# EAGLE schematic OpticalBoardRev1 (EAGLE 8.2.1)
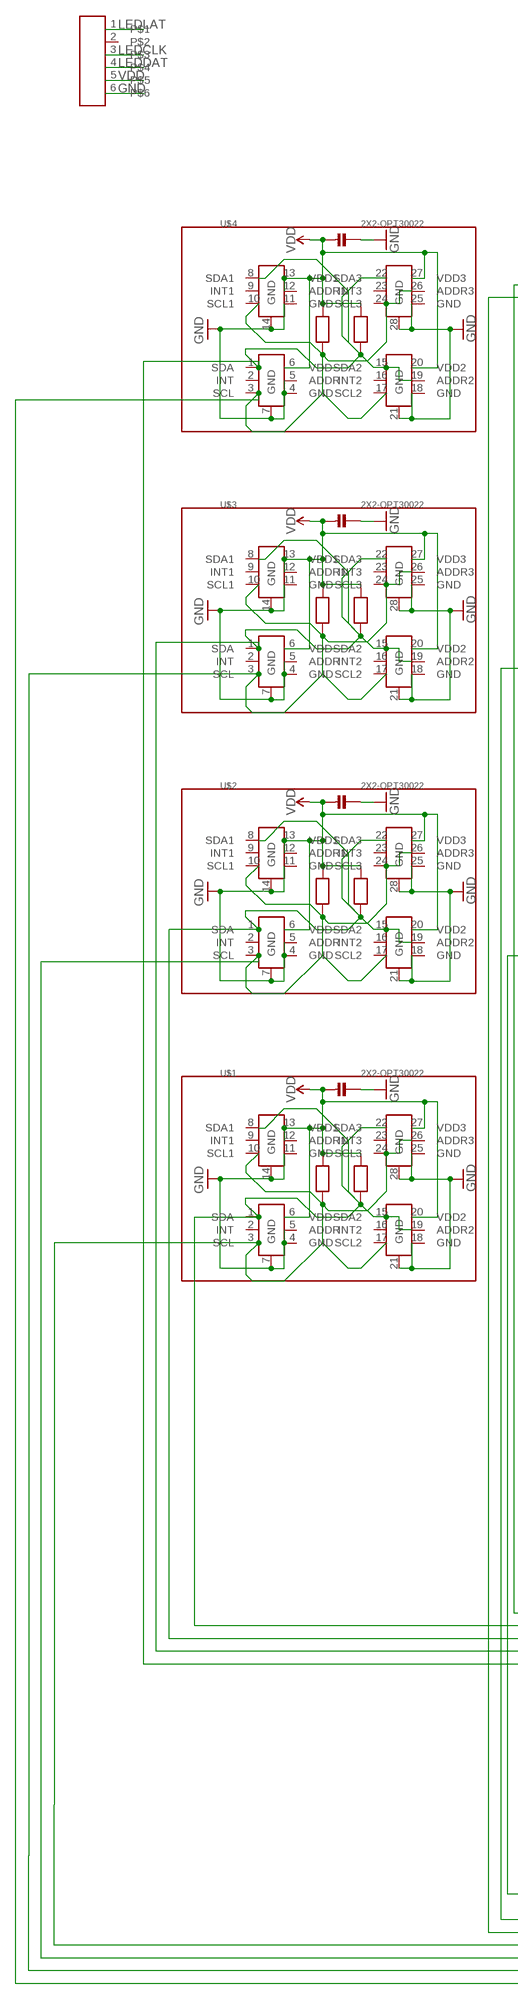
[diagram p0: schematic, sheet 1, part 1 of 2]
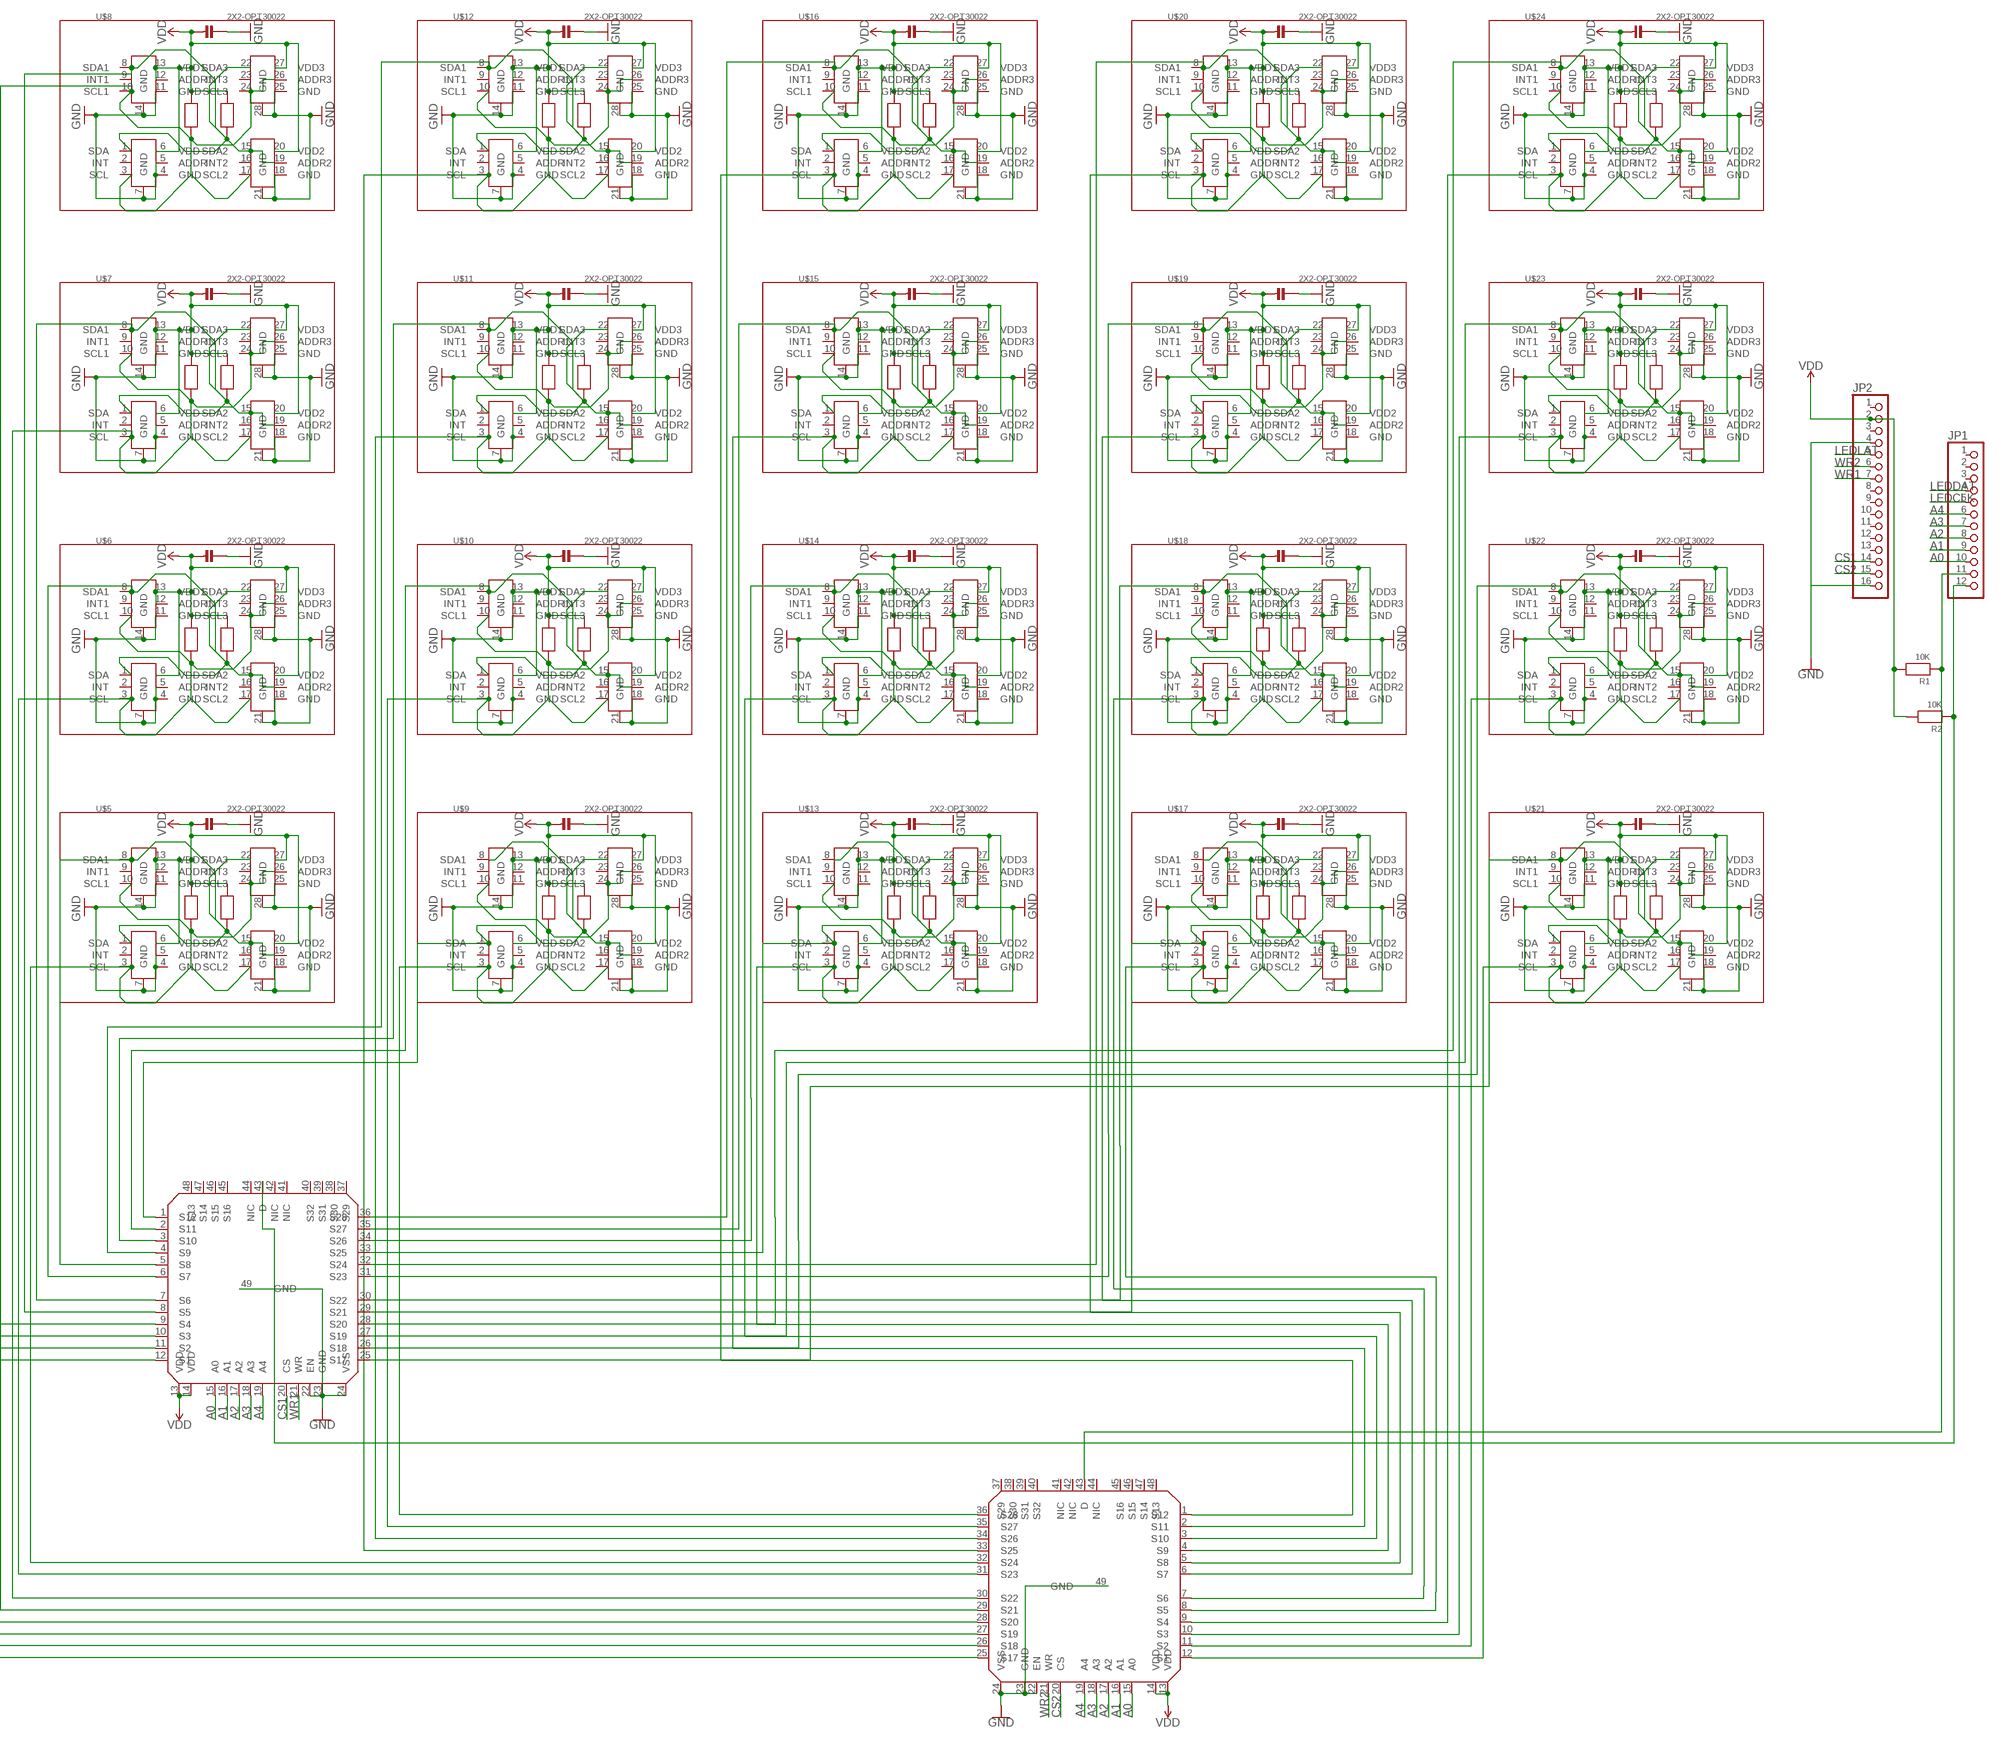
[diagram p1: schematic, sheet 1, part 2 of 2]

## Parts
JP1  HEADER-1X12  [1X12_ROUND]
JP2  HEADER-1X16ROUND  [1X16_ROUND]
R1  10K  RESISTOR_0805  [_0805]
R2  10K  RESISTOR_0805  [_0805]
U$1  2X2-OPT30022  [2X2-OPT3002-2]
U$2  2X2-OPT30022  [2X2-OPT3002-2]
U$3  2X2-OPT30022  [2X2-OPT3002-2]
U$4  2X2-OPT30022  [2X2-OPT3002-2]
U$5  2X2-OPT30022  [2X2-OPT3002-2]
U$6  2X2-OPT30022  [2X2-OPT3002-2]
U$7  2X2-OPT30022  [2X2-OPT3002-2]
U$8  2X2-OPT30022  [2X2-OPT3002-2]
U$9  2X2-OPT30022  [2X2-OPT3002-2]
U$10  2X2-OPT30022  [2X2-OPT3002-2]
U$11  2X2-OPT30022  [2X2-OPT3002-2]
U$12  2X2-OPT30022  [2X2-OPT3002-2]
U$13  2X2-OPT30022  [2X2-OPT3002-2]
U$14  2X2-OPT30022  [2X2-OPT3002-2]
U$15  2X2-OPT30022  [2X2-OPT3002-2]
U$16  2X2-OPT30022  [2X2-OPT3002-2]
U$17  2X2-OPT30022  [2X2-OPT3002-2]
U$18  2X2-OPT30022  [2X2-OPT3002-2]
U$19  2X2-OPT30022  [2X2-OPT3002-2]
U$20  2X2-OPT30022  [2X2-OPT3002-2]
U$21  2X2-OPT30022  [2X2-OPT3002-2]
U$22  2X2-OPT30022  [2X2-OPT3002-2]
U$23  2X2-OPT30022  [2X2-OPT3002-2]
U$24  2X2-OPT30022  [2X2-OPT3002-2]
U$25  CONNECTOR_6PIN  [CONNECTOR_6PIN]
U$26  32MUXTOP  [32MUX]
U$27  32MUXBOT  [32MUX_BOT]

## Nets
A0: JP1.10 U$26.15(A0) U$27.15(A0)
A1: JP1.9 U$26.16(A1) U$27.16(A1)
A2: JP1.8 U$26.17(A2) U$27.17(A2)
A3: JP1.7 U$26.18(A3) U$27.18(A3)
A4: JP1.6 U$26.19(A4) U$27.19(A4)
CS1: JP2.14 U$26.20(CS)
CS2: JP2.15 U$27.20(CS)
GND: JP2.4 JP2.16 U$1.4(GND) U$1.5(ADDR) U$1.7(GND) U$1.11(GND) U$1.14(GND) U$1.18(GND) U$1.21(GND) U$1.25(GND) U$1.28(GND) U$1.30(GND) U$2.4(GND) U$2.5(ADDR) U$2.7(GND) U$2.11(GND) U$2.14(GND) U$2.18(GND) U$2.21(GND) U$2.25(GND) U$2.28(GND) U$2.30(GND) U$3.4(GND) U$3.5(ADDR) U$3.7(GND) U$3.11(GND) U$3.14(GND) U$3.18(GND) U$3.21(GND) U$3.25(GND) U$3.28(GND) U$3.30(GND) U$4.4(GND) U$4.5(ADDR) U$4.7(GND) U$4.11(GND) U$4.14(GND) U$4.18(GND) U$4.21(GND) U$4.25(GND) U$4.28(GND) U$4.30(GND) U$5.4(GND) U$5.5(ADDR) U$5.7(GND) U$5.11(GND) U$5.14(GND) U$5.18(GND) U$5.21(GND) U$5.25(GND) U$5.28(GND) U$5.30(GND) U$6.4(GND) U$6.5(ADDR) U$6.7(GND) U$6.11(GND) U$6.14(GND) U$6.18(GND) U$6.21(GND) U$6.25(GND) U$6.28(GND) U$6.30(GND) U$7.4(GND) U$7.5(ADDR) U$7.7(GND) U$7.11(GND) U$7.14(GND) U$7.18(GND) U$7.21(GND) U$7.25(GND) U$7.28(GND) U$7.30(GND) U$8.4(GND) U$8.5(ADDR) U$8.7(GND) U$8.11(GND) U$8.14(GND) U$8.18(GND) U$8.21(GND) U$8.25(GND) U$8.28(GND) U$8.30(GND) U$9.4(GND) U$9.5(ADDR) U$9.7(GND) U$9.11(GND) U$9.14(GND) U$9.18(GND) U$9.21(GND) U$9.25(GND) U$9.28(GND) U$9.30(GND) U$10.4(GND) U$10.5(ADDR) U$10.7(GND) U$10.11(GND) U$10.14(GND) U$10.18(GND) U$10.21(GND) U$10.25(GND) U$10.28(GND) U$10.30(GND) U$11.4(GND) U$11.5(ADDR) U$11.7(GND) U$11.11(GND) U$11.14(GND) U$11.18(GND) U$11.21(GND) U$11.25(GND) U$11.28(GND) U$11.30(GND) U$12.4(GND) U$12.5(ADDR) U$12.7(GND) U$12.11(GND) U$12.14(GND) U$12.18(GND) U$12.21(GND) U$12.25(GND) U$12.28(GND) U$12.30(GND) U$13.4(GND) U$13.5(ADDR) U$13.7(GND) U$13.11(GND) U$13.14(GND) U$13.18(GND) U$13.21(GND) U$13.25(GND) U$13.28(GND) U$13.30(GND) U$14.4(GND) U$14.5(ADDR) U$14.7(GND) U$14.11(GND) U$14.14(GND) U$14.18(GND) U$14.21(GND) U$14.25(GND) U$14.28(GND) U$14.30(GND) U$15.4(GND) U$15.5(ADDR) U$15.7(GND) U$15.11(GND) U$15.14(GND) U$15.18(GND) U$15.21(GND) U$15.25(GND) U$15.28(GND) U$15.30(GND) U$16.4(GND) U$16.5(ADDR) U$16.7(GND) U$16.11(GND) U$16.14(GND) U$16.18(GND) U$16.21(GND) U$16.25(GND) U$16.28(GND) U$16.30(GND) U$17.4(GND) U$17.5(ADDR) U$17.7(GND) U$17.11(GND) U$17.14(GND) U$17.18(GND) U$17.21(GND) U$17.25(GND) U$17.28(GND) U$17.30(GND) U$18.4(GND) U$18.5(ADDR) U$18.7(GND) U$18.11(GND) U$18.14(GND) U$18.18(GND) U$18.21(GND) U$18.25(GND) U$18.28(GND) U$18.30(GND) U$19.4(GND) U$19.5(ADDR) U$19.7(GND) U$19.11(GND) U$19.14(GND) U$19.18(GND) U$19.21(GND) U$19.25(GND) U$19.28(GND) U$19.30(GND) U$20.4(GND) U$20.5(ADDR) U$20.7(GND) U$20.11(GND) U$20.14(GND) U$20.18(GND) U$20.21(GND) U$20.25(GND) U$20.28(GND) U$20.30(GND) U$21.4(GND) U$21.5(ADDR) U$21.7(GND) U$21.11(GND) U$21.14(GND) U$21.18(GND) U$21.21(GND) U$21.25(GND) U$21.28(GND) U$21.30(GND) U$22.4(GND) U$22.5(ADDR) U$22.7(GND) U$22.11(GND) U$22.14(GND) U$22.18(GND) U$22.21(GND) U$22.25(GND) U$22.28(GND) U$22.30(GND) U$23.4(GND) U$23.5(ADDR) U$23.7(GND) U$23.11(GND) U$23.14(GND) U$23.18(GND) U$23.21(GND) U$23.25(GND) U$23.28(GND) U$23.30(GND) U$24.4(GND) U$24.5(ADDR) U$24.7(GND) U$24.11(GND) U$24.14(GND) U$24.18(GND) U$24.21(GND) U$24.25(GND) U$24.28(GND) U$24.30(GND) U$25.6 U$26.22(EN) U$26.23(GND) U$26.24(VSS) U$26.49(GND) U$27.22(EN) U$27.23(GND) U$27.24(VSS) U$27.49(GND)
LEDCLK: JP1.5 U$25.3
LEDDAT: JP1.4 U$25.4
LEDLAT: JP2.5 U$25.1
SCL1: U$1.3(SCL) U$1.10(SCL1) U$1.17(SCL2) U$1.24(SCL3) U$1.26(ADDR3) U$1.31(R1+) U$27.28(S20)
SCL2: U$2.3(SCL) U$2.10(SCL1) U$2.17(SCL2) U$2.24(SCL3) U$2.26(ADDR3) U$2.31(R1+) U$27.27(S19)
SCL3: U$3.3(SCL) U$3.10(SCL1) U$3.17(SCL2) U$3.24(SCL3) U$3.26(ADDR3) U$3.31(R1+) U$27.26(S18)
SCL4: U$4.3(SCL) U$4.10(SCL1) U$4.17(SCL2) U$4.24(SCL3) U$4.26(ADDR3) U$4.31(R1+) U$27.25(S17)
SCL5: U$5.3(SCL) U$5.10(SCL1) U$5.17(SCL2) U$5.24(SCL3) U$5.26(ADDR3) U$5.31(R1+) U$27.32(S24)
SCL6: U$6.3(SCL) U$6.10(SCL1) U$6.17(SCL2) U$6.24(SCL3) U$6.26(ADDR3) U$6.31(R1+) U$27.31(S23)
SCL7: U$7.3(SCL) U$7.10(SCL1) U$7.17(SCL2) U$7.24(SCL3) U$7.26(ADDR3) U$7.31(R1+) U$27.30(S22)
SCL8: U$8.3(SCL) U$8.10(SCL1) U$8.17(SCL2) U$8.24(SCL3) U$8.26(ADDR3) U$8.31(R1+) U$27.29(S21)
SCL9: U$9.3(SCL) U$9.10(SCL1) U$9.17(SCL2) U$9.24(SCL3) U$9.26(ADDR3) U$9.31(R1+) U$27.36(S28)
SCL10: U$10.3(SCL) U$10.10(SCL1) U$10.17(SCL2) U$10.24(SCL3) U$10.26(ADDR3) U$10.31(R1+) U$27.35(S27)
SCL11: U$11.3(SCL) U$11.10(SCL1) U$11.17(SCL2) U$11.24(SCL3) U$11.26(ADDR3) U$11.31(R1+) U$27.34(S26)
SCL12: U$12.3(SCL) U$12.10(SCL1) U$12.17(SCL2) U$12.24(SCL3) U$12.26(ADDR3) U$12.31(R1+) U$27.33(S25)
SCL13: U$13.3(SCL) U$13.10(SCL1) U$13.17(SCL2) U$13.24(SCL3) U$13.26(ADDR3) U$13.31(R1+) U$27.4(S9)
SCL14: U$14.3(SCL) U$14.10(SCL1) U$14.17(SCL2) U$14.24(SCL3) U$14.26(ADDR3) U$14.31(R1+) U$27.3(S10)
SCL15: U$15.3(SCL) U$15.10(SCL1) U$15.17(SCL2) U$15.24(SCL3) U$15.26(ADDR3) U$15.31(R1+) U$27.2(S11)
SCL16: U$16.3(SCL) U$16.10(SCL1) U$16.17(SCL2) U$16.24(SCL3) U$16.26(ADDR3) U$16.31(R1+) U$27.1(S12)
SCL17: U$17.3(SCL) U$17.10(SCL1) U$17.17(SCL2) U$17.24(SCL3) U$17.26(ADDR3) U$17.31(R1+) U$27.8(S5)
SCL18: U$18.3(SCL) U$18.10(SCL1) U$18.17(SCL2) U$18.24(SCL3) U$18.26(ADDR3) U$18.31(R1+) U$27.7(S6)
SCL19: U$19.3(SCL) U$19.10(SCL1) U$19.17(SCL2) U$19.24(SCL3) U$19.26(ADDR3) U$19.31(R1+) U$27.6(S7)
SCL20: U$20.3(SCL) U$20.10(SCL1) U$20.17(SCL2) U$20.24(SCL3) U$20.26(ADDR3) U$20.31(R1+) U$27.5(S8)
SCL21: U$21.3(SCL) U$21.10(SCL1) U$21.17(SCL2) U$21.24(SCL3) U$21.26(ADDR3) U$21.31(R1+) U$27.12(S1)
SCL22: U$22.3(SCL) U$22.10(SCL1) U$22.17(SCL2) U$22.24(SCL3) U$22.26(ADDR3) U$22.31(R1+) U$27.11(S2)
SCL23: U$23.3(SCL) U$23.10(SCL1) U$23.17(SCL2) U$23.24(SCL3) U$23.26(ADDR3) U$23.31(R1+) U$27.10(S3)
SCL24: U$24.3(SCL) U$24.10(SCL1) U$24.17(SCL2) U$24.24(SCL3) U$24.26(ADDR3) U$24.31(R1+) U$27.9(S4)
SCLK: JP1.11 R1.1 U$27.43(D)
SDA1: U$1.1(SDA) U$1.8(SDA1) U$1.15(SDA2) U$1.19(ADDR2) U$1.22(SDA3) U$1.33(R2+) U$26.9(S4)
SDA2: U$2.1(SDA) U$2.8(SDA1) U$2.15(SDA2) U$2.19(ADDR2) U$2.22(SDA3) U$2.33(R2+) U$26.10(S3)
SDA3: U$3.1(SDA) U$3.8(SDA1) U$3.15(SDA2) U$3.19(ADDR2) U$3.22(SDA3) U$3.33(R2+) U$26.11(S2)
SDA4: U$4.1(SDA) U$4.8(SDA1) U$4.15(SDA2) U$4.19(ADDR2) U$4.22(SDA3) U$4.33(R2+) U$26.12(S1)
SDA5: U$5.1(SDA) U$5.8(SDA1) U$5.15(SDA2) U$5.19(ADDR2) U$5.22(SDA3) U$5.33(R2+) U$26.5(S8)
SDA6: U$6.1(SDA) U$6.8(SDA1) U$6.15(SDA2) U$6.19(ADDR2) U$6.22(SDA3) U$6.33(R2+) U$26.6(S7)
SDA7: U$7.1(SDA) U$7.8(SDA1) U$7.15(SDA2) U$7.19(ADDR2) U$7.22(SDA3) U$7.33(R2+) U$26.7(S6)
SDA8: U$8.1(SDA) U$8.8(SDA1) U$8.15(SDA2) U$8.19(ADDR2) U$8.22(SDA3) U$8.33(R2+) U$26.8(S5)
SDA9: U$9.1(SDA) U$9.8(SDA1) U$9.15(SDA2) U$9.19(ADDR2) U$9.22(SDA3) U$9.33(R2+) U$26.1(S12)
SDA10: U$10.1(SDA) U$10.8(SDA1) U$10.15(SDA2) U$10.19(ADDR2) U$10.22(SDA3) U$10.33(R2+) U$26.2(S11)
SDA11: U$11.1(SDA) U$11.8(SDA1) U$11.15(SDA2) U$11.19(ADDR2) U$11.22(SDA3) U$11.33(R2+) U$26.3(S10)
SDA12: U$12.1(SDA) U$12.8(SDA1) U$12.15(SDA2) U$12.19(ADDR2) U$12.22(SDA3) U$12.33(R2+) U$26.4(S9)
SDA13: U$13.1(SDA) U$13.8(SDA1) U$13.15(SDA2) U$13.19(ADDR2) U$13.22(SDA3) U$13.33(R2+) U$26.33(S25)
SDA14: U$14.1(SDA) U$14.8(SDA1) U$14.15(SDA2) U$14.19(ADDR2) U$14.22(SDA3) U$14.33(R2+) U$26.34(S26)
SDA15: U$15.1(SDA) U$15.8(SDA1) U$15.15(SDA2) U$15.19(ADDR2) U$15.22(SDA3) U$15.33(R2+) U$26.35(S27)
SDA16: U$16.1(SDA) U$16.8(SDA1) U$16.15(SDA2) U$16.19(ADDR2) U$16.22(SDA3) U$16.33(R2+) U$26.36(S28)
SDA17: U$17.1(SDA) U$17.8(SDA1) U$17.15(SDA2) U$17.19(ADDR2) U$17.22(SDA3) U$17.33(R2+) U$26.29(S21)
SDA18: U$18.1(SDA) U$18.8(SDA1) U$18.15(SDA2) U$18.19(ADDR2) U$18.22(SDA3) U$18.33(R2+) U$26.30(S22)
SDA19: U$19.1(SDA) U$19.8(SDA1) U$19.15(SDA2) U$19.19(ADDR2) U$19.22(SDA3) U$19.33(R2+) U$26.31(S23)
SDA20: U$20.1(SDA) U$20.8(SDA1) U$20.15(SDA2) U$20.19(ADDR2) U$20.22(SDA3) U$20.33(R2+) U$26.32(S24)
SDA21: U$21.1(SDA) U$21.8(SDA1) U$21.15(SDA2) U$21.19(ADDR2) U$21.22(SDA3) U$21.33(R2+) U$26.25(S17)
SDA22: U$22.1(SDA) U$22.8(SDA1) U$22.15(SDA2) U$22.19(ADDR2) U$22.22(SDA3) U$22.33(R2+) U$26.26(S18)
SDA23: U$23.1(SDA) U$23.8(SDA1) U$23.15(SDA2) U$23.19(ADDR2) U$23.22(SDA3) U$23.33(R2+) U$26.27(S19)
SDA24: U$24.1(SDA) U$24.8(SDA1) U$24.15(SDA2) U$24.19(ADDR2) U$24.22(SDA3) U$24.33(R2+) U$26.28(S20)
SDAT: JP1.12 R2.1 U$26.43(D)
VDD: JP2.2 R1.2 R2.2 U$1.6(VDD) U$1.12(ADDR1) U$1.13(VDD1) U$1.20(VDD2) U$1.27(VDD3) U$1.29(C+) U$1.32(GND) U$1.34(GND) U$2.6(VDD) U$2.12(ADDR1) U$2.13(VDD1) U$2.20(VDD2) U$2.27(VDD3) U$2.29(C+) U$2.32(GND) U$2.34(GND) U$3.6(VDD) U$3.12(ADDR1) U$3.13(VDD1) U$3.20(VDD2) U$3.27(VDD3) U$3.29(C+) U$3.32(GND) U$3.34(GND) U$4.6(VDD) U$4.12(ADDR1) U$4.13(VDD1) U$4.20(VDD2) U$4.27(VDD3) U$4.29(C+) U$4.32(GND) U$4.34(GND) U$5.6(VDD) U$5.12(ADDR1) U$5.13(VDD1) U$5.20(VDD2) U$5.27(VDD3) U$5.29(C+) U$5.32(GND) U$5.34(GND) U$6.6(VDD) U$6.12(ADDR1) U$6.13(VDD1) U$6.20(VDD2) U$6.27(VDD3) U$6.29(C+) U$6.32(GND) U$6.34(GND) U$7.6(VDD) U$7.12(ADDR1) U$7.13(VDD1) U$7.20(VDD2) U$7.27(VDD3) U$7.29(C+) U$7.32(GND) U$7.34(GND) U$8.6(VDD) U$8.12(ADDR1) U$8.13(VDD1) U$8.20(VDD2) U$8.27(VDD3) U$8.29(C+) U$8.32(GND) U$8.34(GND) U$9.6(VDD) U$9.12(ADDR1) U$9.13(VDD1) U$9.20(VDD2) U$9.27(VDD3) U$9.29(C+) U$9.32(GND) U$9.34(GND) U$10.6(VDD) U$10.12(ADDR1) U$10.13(VDD1) U$10.20(VDD2) U$10.27(VDD3) U$10.29(C+) U$10.32(GND) U$10.34(GND) U$11.6(VDD) U$11.12(ADDR1) U$11.13(VDD1) U$11.20(VDD2) U$11.27(VDD3) U$11.29(C+) U$11.32(GND) U$11.34(GND) U$12.6(VDD) U$12.12(ADDR1) U$12.13(VDD1) U$12.20(VDD2) U$12.27(VDD3) U$12.29(C+) U$12.32(GND) U$12.34(GND) U$13.6(VDD) U$13.12(ADDR1) U$13.13(VDD1) U$13.20(VDD2) U$13.27(VDD3) U$13.29(C+) U$13.32(GND) U$13.34(GND) U$14.6(VDD) U$14.12(ADDR1) U$14.13(VDD1) U$14.20(VDD2) U$14.27(VDD3) U$14.29(C+) U$14.32(GND) U$14.34(GND) U$15.6(VDD) U$15.12(ADDR1) U$15.13(VDD1) U$15.20(VDD2) U$15.27(VDD3) U$15.29(C+) U$15.32(GND) U$15.34(GND) U$16.6(VDD) U$16.12(ADDR1) U$16.13(VDD1) U$16.20(VDD2) U$16.27(VDD3) U$16.29(C+) U$16.32(GND) U$16.34(GND) U$17.6(VDD) U$17.12(ADDR1) U$17.13(VDD1) U$17.20(VDD2) U$17.27(VDD3) U$17.29(C+) U$17.32(GND) U$17.34(GND) U$18.6(VDD) U$18.12(ADDR1) U$18.13(VDD1) U$18.20(VDD2) U$18.27(VDD3) U$18.29(C+) U$18.32(GND) U$18.34(GND) U$19.6(VDD) U$19.12(ADDR1) U$19.13(VDD1) U$19.20(VDD2) U$19.27(VDD3) U$19.29(C+) U$19.32(GND) U$19.34(GND) U$20.6(VDD) U$20.12(ADDR1) U$20.13(VDD1) U$20.20(VDD2) U$20.27(VDD3) U$20.29(C+) U$20.32(GND) U$20.34(GND) U$21.6(VDD) U$21.12(ADDR1) U$21.13(VDD1) U$21.20(VDD2) U$21.27(VDD3) U$21.29(C+) U$21.32(GND) U$21.34(GND) U$22.6(VDD) U$22.12(ADDR1) U$22.13(VDD1) U$22.20(VDD2) U$22.27(VDD3) U$22.29(C+) U$22.32(GND) U$22.34(GND) U$23.6(VDD) U$23.12(ADDR1) U$23.13(VDD1) U$23.20(VDD2) U$23.27(VDD3) U$23.29(C+) U$23.32(GND) U$23.34(GND) U$24.6(VDD) U$24.12(ADDR1) U$24.13(VDD1) U$24.20(VDD2) U$24.27(VDD3) U$24.29(C+) U$24.32(GND) U$24.34(GND) U$25.5 U$26.13(VDD) U$26.14(VDD) U$27.13(VDD) U$27.14(VDD)
WR1: JP2.7 U$26.21(WR)
WR2: JP2.6 U$27.21(WR)
Unconnected: JP1.1 JP1.2 JP1.3 JP2.1 JP2.3 JP2.8 JP2.9 JP2.10 JP2.11 JP2.12 JP2.13 U$1.2(INT) U$1.9(INT1) U$1.16(INT2) U$1.23(INT3) U$2.2(INT) U$2.9(INT1) U$2.16(INT2) U$2.23(INT3) U$3.2(INT) U$3.9(INT1) U$3.16(INT2) U$3.23(INT3) U$4.2(INT) U$4.9(INT1) U$4.16(INT2) U$4.23(INT3) U$5.2(INT) U$5.9(INT1) U$5.16(INT2) U$5.23(INT3) U$6.2(INT) U$6.9(INT1) U$6.16(INT2) U$6.23(INT3) U$7.2(INT) U$7.9(INT1) U$7.16(INT2) U$7.23(INT3) U$8.2(INT) U$8.9(INT1) U$8.16(INT2) U$8.23(INT3) U$9.2(INT) U$9.9(INT1) U$9.16(INT2) U$9.23(INT3) U$10.2(INT) U$10.9(INT1) U$10.16(INT2) U$10.23(INT3) U$11.2(INT) U$11.9(INT1) U$11.16(INT2) U$11.23(INT3) U$12.2(INT) U$12.9(INT1) U$12.16(INT2) U$12.23(INT3) U$13.2(INT) U$13.9(INT1) U$13.16(INT2) U$13.23(INT3) U$14.2(INT) U$14.9(INT1) U$14.16(INT2) U$14.23(INT3) U$15.2(INT) U$15.9(INT1) U$15.16(INT2) U$15.23(INT3) U$16.2(INT) U$16.9(INT1) U$16.16(INT2) U$16.23(INT3) U$17.2(INT) U$17.9(INT1) U$17.16(INT2) U$17.23(INT3) U$18.2(INT) U$18.9(INT1) U$18.16(INT2) U$18.23(INT3) U$19.2(INT) U$19.9(INT1) U$19.16(INT2) U$19.23(INT3) U$20.2(INT) U$20.9(INT1) U$20.16(INT2) U$20.23(INT3) U$21.2(INT) U$21.9(INT1) U$21.16(INT2) U$21.23(INT3) U$22.2(INT) U$22.9(INT1) U$22.16(INT2) U$22.23(INT3) U$23.2(INT) U$23.9(INT1) U$23.16(INT2) U$23.23(INT3) U$24.2(INT) U$24.9(INT1) U$24.16(INT2) U$24.23(INT3) U$25.2 U$26.37(S29) U$26.38(S30) U$26.39(S31) U$26.40(S32) U$26.41(NIC) U$26.42(NIC) U$26.44(NIC) U$26.45(S16) U$26.46(S15) U$26.47(S14) U$26.48(S13) U$27.37(S29) U$27.38(S30) U$27.39(S31) U$27.40(S32) U$27.41(NIC) U$27.42(NIC) U$27.44(NIC) U$27.45(S16) U$27.46(S15) U$27.47(S14) U$27.48(S13)

## Library data of the parts
JP1 = Adafruit Feather 32u4 Adalogger:HEADER-1X12
JP2 = Adafruit Feather 32u4 Adalogger:HEADER-1X16: PIN HEADER
R1 R2 = Adafruit TLC5947:RESISTOR: Resistors For new designs, use the packages preceded by an '_' character since they are more reliable: The following footprints should be used on most boards: _0402 - Standard footprint for regular board layouts _0603 - Standard footprint for regular board layouts _0805 - Standard footprint for regular board layouts For extremely tight-pitch boards where space is at a premium, the following 'micro-pitch' footprints can be used (smaller pads, no silkscreen outline, etc.): _0402MP - Micro-pitch footprint for very dense/compact boards _0603MP - Micro-pitch footprint for very dense/compact boards _0805MP - Micro-pitch footprint for very dense/compact boards
U$1-U$24 = TIcustom:2X2-OPT3002
U$25 = TIcustom:CONNECTOR_6PIN
U$26 U$27 = TIcustom:32MUX